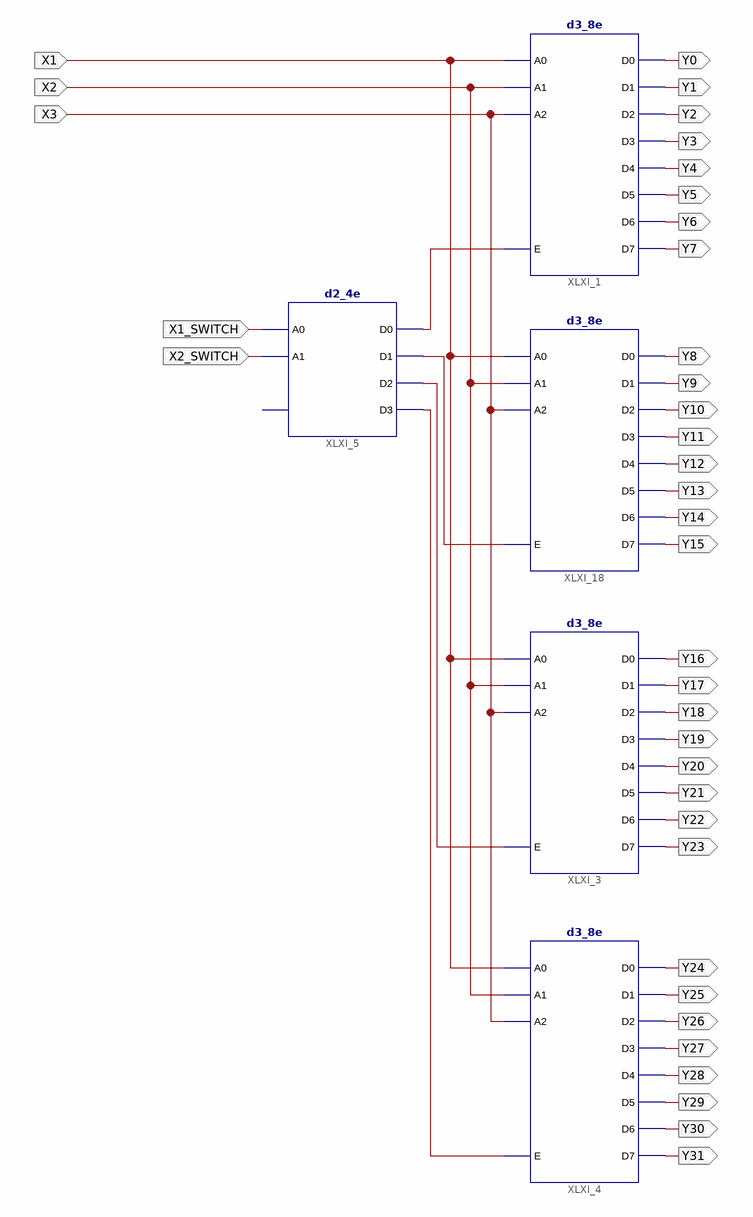
[diagram p0: schematic sheet 1]
// Xilinx ISE schematic scheme_pt1.sch (virtex5) as structural Verilog: 5 symbols, 37 ports
module scheme_pt1 (
  input  X3,
  input  X1,
  input  X2,
  input  X1_SWITCH,
  input  X2_SWITCH,
  output Y0,
  output Y1,
  output Y2,
  output Y3,
  output Y4,
  output Y5,
  output Y6,
  output Y7,
  output Y8,
  output Y9,
  output Y10,
  output Y11,
  output Y12,
  output Y13,
  output Y14,
  output Y15,
  output Y16,
  output Y17,
  output Y18,
  output Y19,
  output Y20,
  output Y21,
  output Y22,
  output Y23,
  output Y24,
  output Y25,
  output Y26,
  output Y27,
  output Y28,
  output Y29,
  output Y30,
  output Y31
);

  wire XLXN_32, XLXN_56, XLXN_57, XLXN_58;

  d3_8e XLXI_1 (
    .A0(X1), .A1(X2), .A2(X3), .E(XLXN_32), .D0(Y0), .D1(Y1), .D2(Y2), .D3(Y3), .D4(Y4), .D5(Y5), .D6(Y6),
    .D7(Y7));
  d2_4e XLXI_5 (.A0(X1_SWITCH), .A1(X2_SWITCH), .D0(XLXN_32), .D1(XLXN_56), .D2(XLXN_57), .D3(XLXN_58));  // open: E
  d3_8e XLXI_4 (
    .A0(X1), .A1(X2), .A2(X3), .E(XLXN_58), .D0(Y24), .D1(Y25), .D2(Y26), .D3(Y27), .D4(Y28), .D5(Y29),
    .D6(Y30), .D7(Y31));
  d3_8e XLXI_3 (
    .A0(X1), .A1(X2), .A2(X3), .E(XLXN_57), .D0(Y16), .D1(Y17), .D2(Y18), .D3(Y19), .D4(Y20), .D5(Y21),
    .D6(Y22), .D7(Y23));
  d3_8e XLXI_18 (
    .A0(X1), .A1(X2), .A2(X3), .E(XLXN_56), .D0(Y8), .D1(Y9), .D2(Y10), .D3(Y11), .D4(Y12), .D5(Y13),
    .D6(Y14), .D7(Y15));
endmodule
